# Altium project ultra.PrjPCB
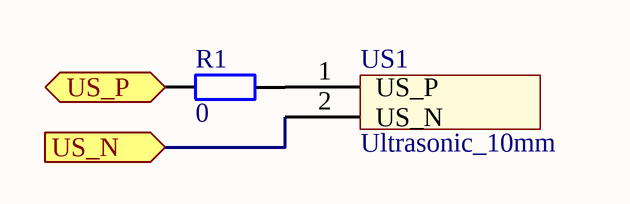
[diagram p0: ultra.SchDoc]
1 sheet, 2 parts. Net scope: flat (ports and power ports of the same name join across sheets).
Board files: PCB1.PcbDoc, ultra.PcbDoc

## Sheet ultra.SchDoc
size A1

### Parts
R1  0  [R-0603-M]
US1  Ultrasonic_10mm  [ULTRA_10]

### Ports
US_N (in), US_P (in)

### Nets
NetR1_1: R1.1 ; port US_P
NetR1_2: R1.2 US1.1(US_P)
NetUS1_2: US1.2(US_N) ; port US_N

### Library data of the parts
R1 = R-0603-0: Resistor 0; Supplier 1: Mouser; Supplier Part Number 1: 71-CRCW0603-0-E3; Resistance: 0